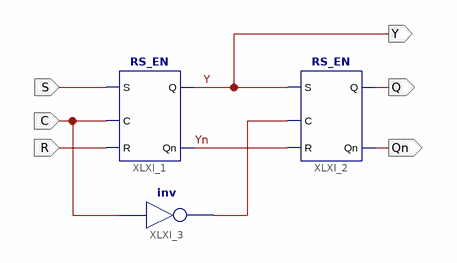
[diagram p0: schematic sheet 1]
// Xilinx ISE schematic RS_Trig.sch (kintex7) as structural Verilog: 3 symbols, 6 ports
module RS_Trig (
  input  C,
  input  R,
  input  S,
  output Q,
  output Qn,
  output Y
);

  wire XLXN_11, Yn;

  RS_EN XLXI_1 (.Q(Y), .Qn(Yn), .C(C), .S(S), .R(R));
  RS_EN XLXI_2 (.Q(Q), .Qn(Qn), .C(XLXN_11), .S(Y), .R(Yn));
  not XLXI_3 (XLXN_11, C);
endmodule
